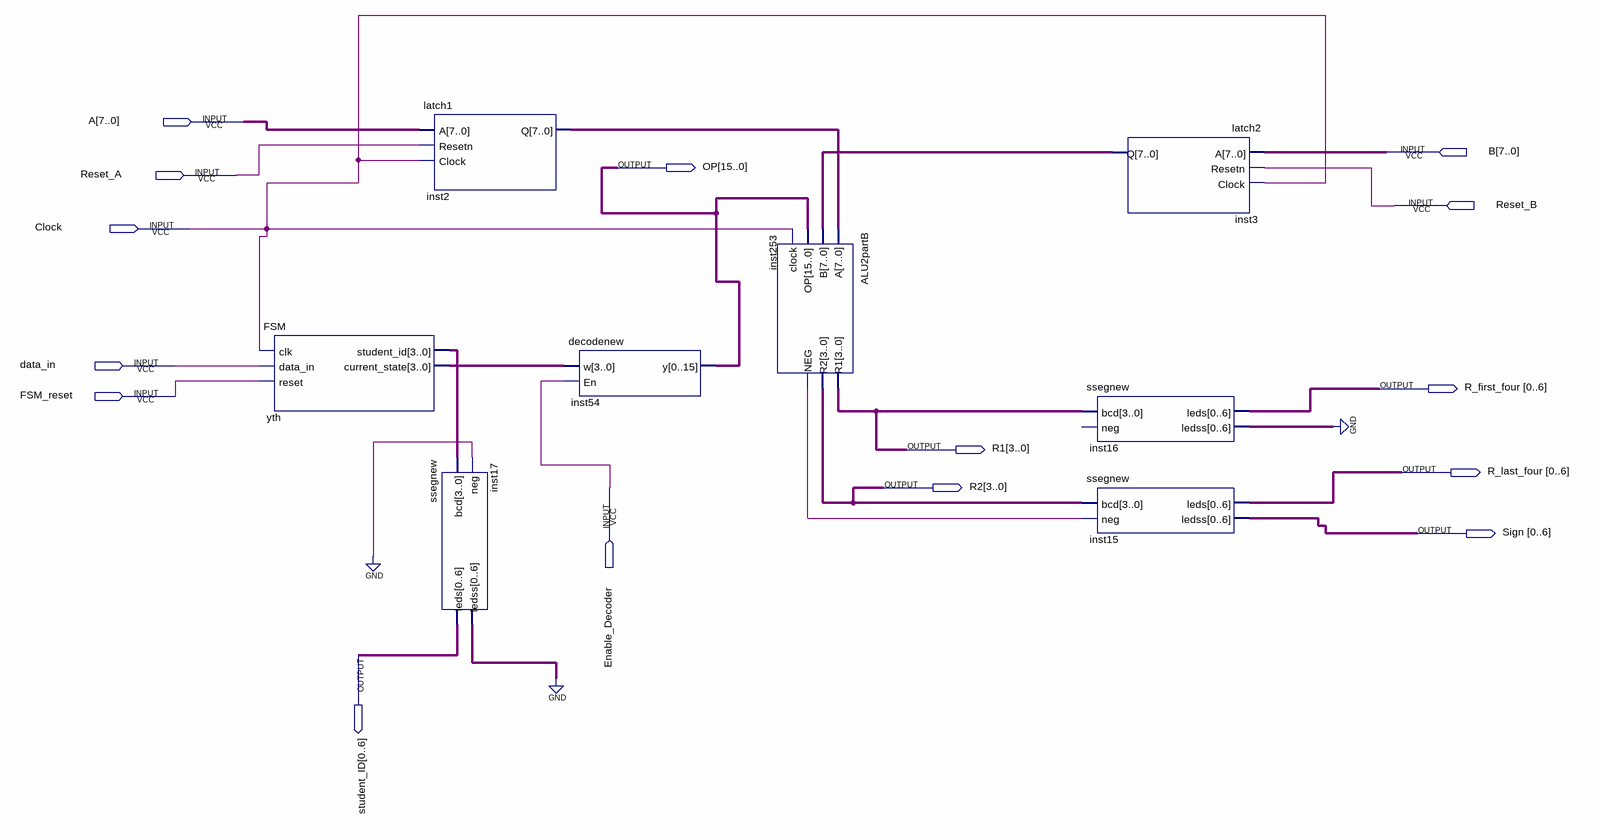
[diagram p0: schematic sheet]
// Quartus schematic ALU2partBdiagram.bdf as structural Verilog: 8 symbols, 15 pins
module ALU2partBdiagram (
  input  [7:0] A,
  input  [7:0] B,
  input  Reset_A,
  input  Reset_B,
  input  Clock,
  input  data_in,
  input  FSM_reset,
  input  Enable_Decoder,
  output [15:0] OP,
  output [0:6] R_first_four,
  output [3:0] R1,
  output [0:6] R_last_four,
  output [3:0] R2,
  output [0:6] Sign,
  output [0:6] student_ID
);

  wire inst253_neg;
  wire [3:0] yth_current_state, yth_student_id;
  wire [6:0] inst16_ledss, inst17_ledss;
  wire [7:0] inst2_q, inst3_q;

  FSM yth (
    .clk(Clock), .data_in(data_in), .reset(FSM_reset), .student_id(yth_student_id),
    .current_state(yth_current_state));
  latch1 inst2 (.A(A), .Resetn(Reset_A), .Clock(Clock), .Q(inst2_q));
  ssegnew inst17 (.bcd(yth_student_id), .neg(1'b0), .leds(student_ID), .ledss(inst17_ledss));
  decodenew inst54 (.w(yth_current_state), .En(Enable_Decoder), .y(OP));
  ALU2partB inst253 (.A(inst2_q), .B(inst3_q), .OP(OP), .clock(Clock), .R1(R1), .R2(R2), .NEG(inst253_neg));
  ssegnew inst16 (.bcd(R1), .leds(R_first_four), .ledss(inst16_ledss));  // open: neg
  ssegnew inst15 (.bcd(R2), .neg(inst253_neg), .leds(R_last_four), .ledss(Sign));
  latch2 inst3 (.A(B), .Resetn(Reset_B), .Clock(Clock), .Q(inst3_q));
  // also tied to GND on the sheet: {inst17_ledss[0], inst17_ledss[1], inst17_ledss[2], inst17_ledss[3], inst17_ledss[4], inst17_ledss[5], inst17_ledss[6], inst16_ledss[0], inst16_ledss[1], inst16_ledss[2], inst16_ledss[3], inst16_ledss[4], inst16_ledss[5], inst16_ledss[6]}
endmodule
